# Altium schematic sheet sch_LIMA_Driver.SchDoc
size A4
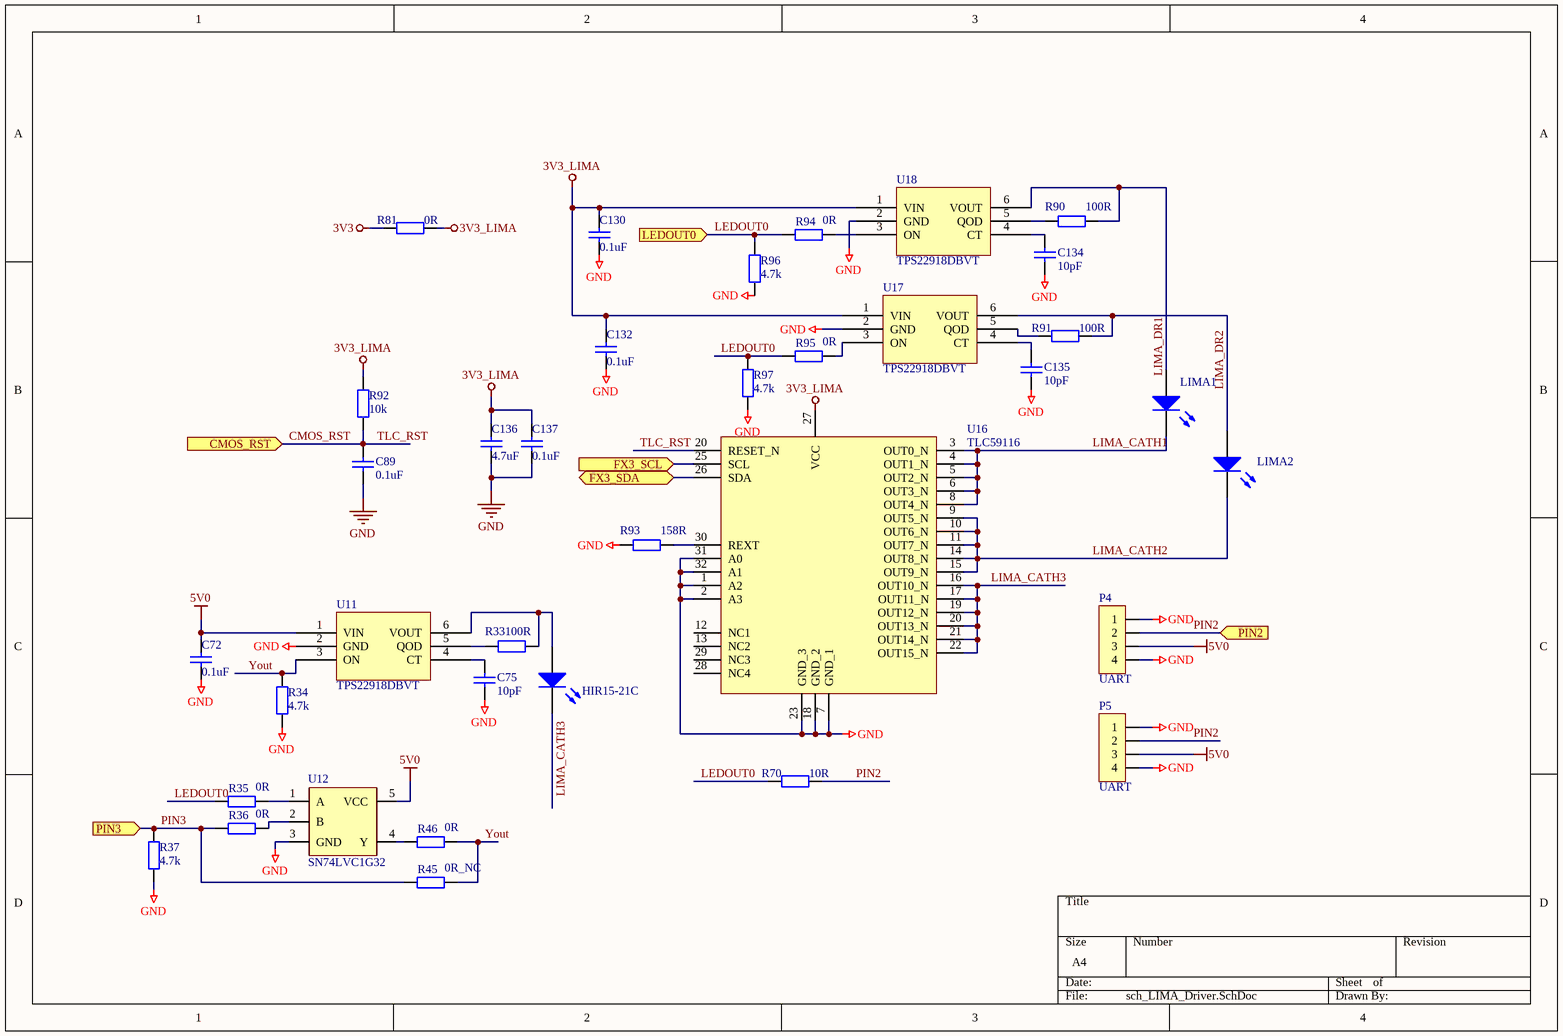
[diagram p0: sch_LIMA_Driver.SchDoc]

## Parts
C72  0.1uF
C75  10pF  [0603C_N]
C89  0.1uF  [0402C_L]
C130  0.1uF  [0402C_L]
C132  0.1uF  [0402C_L]
C134  10pF  [0402C_L]
C135  10pF  [0402C_L]
C136  4.7uF
C137  0.1uF  [0402C]
HIR15-21C  LIMA  [1206R]  (value not drawn)
LIMA1  LIMA  (value not drawn)
LIMA2  LIMA  (value not drawn)
P4  UART  [WAFER4_P1.25L6.25W3.4H4.3]
P5  UART  [WAFER4_P1.25L6.25W3.4H4.3]
R33  100R  [0603R_N]
R34  4.7k  [0603R_N]
R35  0R  [0603R_N]
R36  0R  [0603R_N]
R37  4.7k  [0603R_N]
R45  0R_NC  [0603R_N]
R46  0R  [0603R_N]
R70  10R  [0402R]
R81  0R  [0402R]
R90  100R  [0402R]
R91  100R  [0402R]
R92  10k  [0402R]
R93  158R  [0402R]
R94  0R  [0402R]
R95  0R  [0402R]
R96  4.7k  [0402R]
R97  4.7k  [0402R]
U11  TPS22918DBVT  [SOT23-6_P0.95X2.4_L3W4.2H1.1]
U12  SN74LVC1G32  [SOT23-5_P0.95X2.4_L3W4.2H1.1]
U16  TLC59116
U17  TPS22918DBVT
U18  TPS22918DBVT

## Ports
CMOS_RST (in), FX3_SCL (in), FX3_SDA (bidir), LEDOUT0 (in), PIN2 (in), PIN3 (in)

## Nets
3V3: R81.1
3V3_LIMA: C130.2 C132.2 C136.2 C137.2 R81.2 R92.1 U16.27(VCC) U17.1(VIN) U18.1(VIN)
5V0: C72.2 P4.3 P5.3 U11.1(VIN) U12.5(VCC)
GND: C72.1 C75.1 C89.1 C130.1 C132.1 C134.1 C135.1 C136.1 C137.1 P4.1 P4.4 P5.1 P5.4 R34.1 R37.1 R93.2 R96.1 R97.1 U11.2(GND) U12.3(GND) U16.1(A2) U16.2(A3) U16.7(GND_1) U16.18(GND_2) U16.23(GND_3) U16.31(A0) U16.32(A1) U17.2(GND) U18.2(GND)
CMOS_RST: C89.2 R92.2 U16.20(RESET_N) ; port CMOS_RST  [also labelled TLC_RST]
FX3_SCL: U16.25(SCL) ; port FX3_SCL
FX3_SDA: U16.26(SDA) ; port FX3_SDA
LEDOUT0: R35.2 R70.1 R94.2 R95.2 R96.2 R97.2 ; port LEDOUT0
LIMA_CATH1: LIMA1.2(K) U16.3(OUT0_N) U16.4(OUT1_N) U16.5(OUT2_N) U16.6(OUT3_N) U16.8(OUT4_N)
LIMA_CATH2: LIMA2.2(K) U16.9(OUT5_N) U16.10(OUT6_N) U16.11(OUT7_N) U16.14(OUT8_N) U16.15(OUT9_N)
LIMA_CATH3: HIR15-21C.2(K) U16.16(OUT10_N) U16.17(OUT11_N) U16.19(OUT12_N) U16.20(OUT13_N) U16.21(OUT14_N) U16.22(OUT15_N)
LIMA_DR2: LIMA2.1(A) R91.1 U17.6(VOUT)
PIN2: P4.2 P5.2 R70.2 ; port PIN2
PIN3: R36.2 R37.2 R45.2 ; port PIN3
Yout: R34.2 R45.1 R46.1 U11.3(ON)
NetC75_2: C75.2 U11.4(CT)
NetC134_2: C134.2 U18.4(CT)
NetC135_2: C135.2 U17.4(CT)
NetHIR15-21C_1: HIR15-21C.1(A) R33.1 U11.6(VOUT)
NetLIMA1_1: LIMA1.1(A) R90.1 U18.6(VOUT)
NetR33_2: R33.2 U11.5(QOD)
NetR35_1: R35.1 U12.1(A)
NetR36_1: R36.1 U12.2(B)
NetR46_2: R46.2 U12.4(Y)
NetR90_2: R90.2 U18.5(QOD)
NetR91_2: R91.2 U17.5(QOD)
NetR93_1: R93.1 U16.30(REXT)
NetR94_1: R94.1 U18.3(ON)
NetR95_1: R95.1 U17.3(ON)

Not connected (* = marked no-connect by the designer): U16 12(NC1) 13(NC2) 28(NC4) 29(NC3)

## Notes on the sheet
- Labels drawn without touching a wire or pin: LIMA_DR1

## Library data of the parts
C72 C75 C89 C130 C132 C134 C135 = Cap: Capacitor; Published: 8-Jun-2000; LatestRevisionDate: 17-Jul-2002; LatestRevisionNote: Re-released for DXP Platform.; Publisher: Altium Limited
  C72 C89 C130 C132: Value: 0.1uF
  C75 C134 C135: Value: 10pF
C136 = Cap: Capacitor; Value: 0805; Published: 8-Jun-2000; LatestRevisionDate: 17-Jul-2002; LatestRevisionNote: Re-released for DXP Platform.; PackageReference: RAD-0.3; Publisher: Altium Limited
C137 = Cap: Capacitor; Value: C0402; Published: 8-Jun-2000; LatestRevisionDate: 17-Jul-2002; LatestRevisionNote: Re-released for DXP Platform.; Publisher: Altium Limited
HIR15-21C LIMA1 LIMA2 = LED: 发光二级管
P4 P5 = CON4
R33-R37 R45 R46 R90-R97 = Resistor: Value: 100; Published: 8-Jun-2000; LatestRevisionDate: 17-Jul-2002; LatestRevisionNote: Re-released for DXP Platform.; PackageReference: AXIAL-0.4; Publisher: Altium Limited
R70 R81 = Resistor: Published: 8-Jun-2000; LatestRevisionDate: 17-Jul-2002; LatestRevisionNote: Re-released for DXP Platform.; PackageReference: AXIAL-0.4; Publisher: Altium Limited
  R70: Value: 10R
  R81: Value: 0R